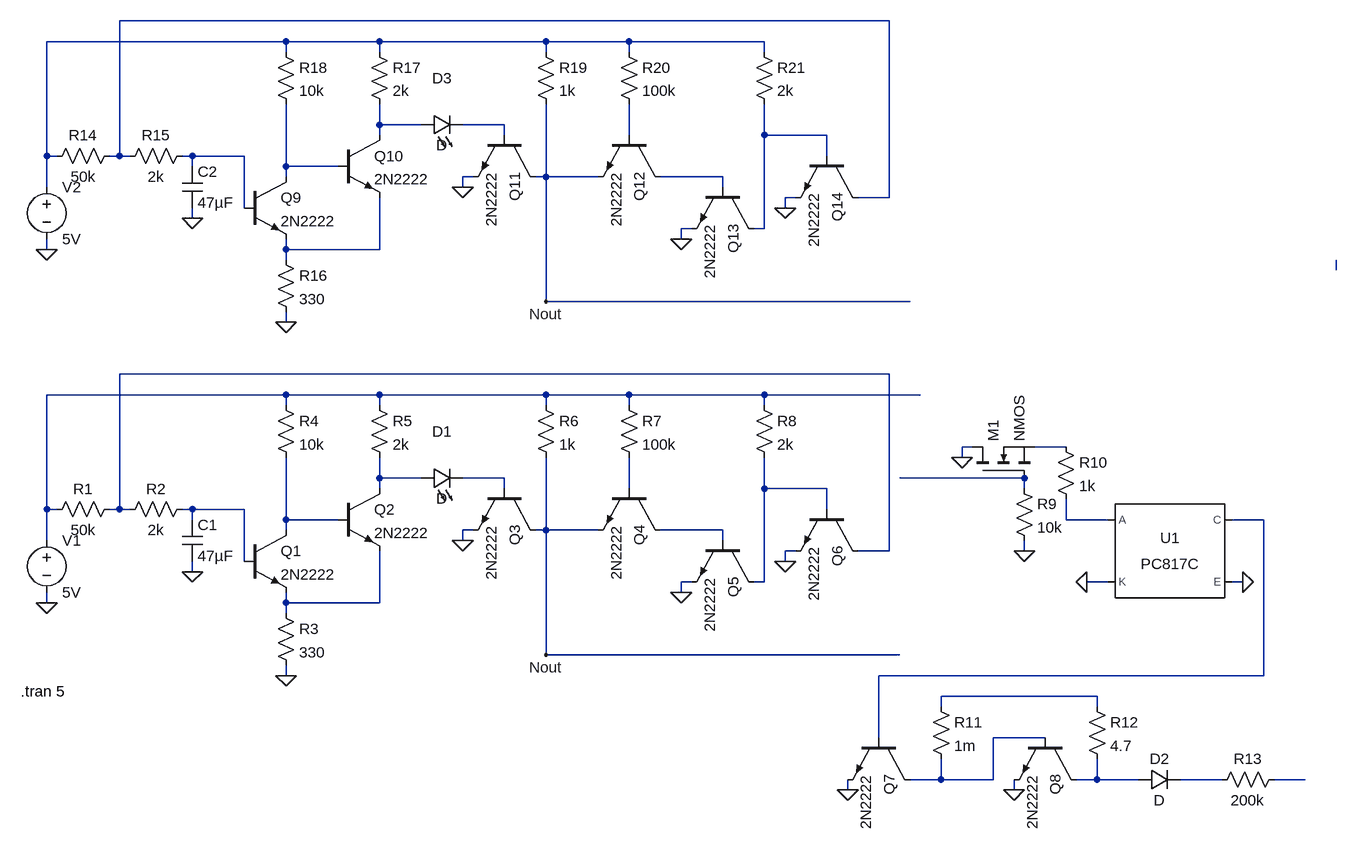
[diagram p0: schematic NeuronSynapseVersion1.asc]
NeuronSynapseVersion1.asc, the LTspice schematic file:
Version 4.1
SHEET 1 2296 680
WIRE 1440 -672 256 -672
WIRE 512 -640 144 -640
WIRE 656 -640 512 -640
WIRE 912 -640 656 -640
WIRE 1040 -640 912 -640
WIRE 1248 -640 1040 -640
WIRE 512 -624 512 -640
WIRE 656 -624 656 -640
WIRE 912 -624 912 -640
WIRE 1040 -624 1040 -640
WIRE 1248 -624 1248 -640
WIRE 656 -512 656 -544
WIRE 720 -512 656 -512
WIRE 848 -512 784 -512
WIRE 656 -496 656 -512
WIRE 848 -496 848 -512
WIRE 1040 -496 1040 -544
WIRE 1248 -496 1248 -544
WIRE 1344 -496 1248 -496
WIRE 144 -464 144 -640
WIRE 160 -464 144 -464
WIRE 256 -464 256 -672
WIRE 256 -464 240 -464
WIRE 272 -464 256 -464
WIRE 368 -464 352 -464
WIRE 448 -464 368 -464
WIRE 1344 -464 1344 -496
WIRE 368 -448 368 -464
WIRE 512 -448 512 -544
WIRE 592 -448 512 -448
WIRE 512 -432 512 -448
WIRE 800 -432 784 -432
WIRE 912 -432 912 -544
WIRE 912 -432 896 -432
WIRE 992 -432 912 -432
WIRE 1184 -432 1088 -432
WIRE 144 -416 144 -464
WIRE 784 -416 784 -432
WIRE 1184 -416 1184 -432
WIRE 1296 -400 1280 -400
WIRE 1440 -400 1440 -672
WIRE 1440 -400 1392 -400
WIRE 448 -384 448 -464
WIRE 1280 -384 1280 -400
WIRE 368 -368 368 -384
WIRE 1136 -352 1120 -352
WIRE 1248 -352 1248 -496
WIRE 1248 -352 1232 -352
WIRE 1120 -336 1120 -352
WIRE 144 -320 144 -336
WIRE 512 -320 512 -336
WIRE 656 -320 656 -400
WIRE 656 -320 512 -320
WIRE 512 -304 512 -320
WIRE 2128 -288 2128 -304
WIRE 912 -240 912 -432
WIRE 1472 -240 912 -240
WIRE 512 -208 512 -224
WIRE 1440 -128 256 -128
WIRE 512 -96 144 -96
WIRE 656 -96 512 -96
WIRE 912 -96 656 -96
WIRE 1040 -96 912 -96
WIRE 1248 -96 1040 -96
WIRE 1488 -96 1248 -96
WIRE 512 -80 512 -96
WIRE 656 -80 656 -96
WIRE 912 -80 912 -96
WIRE 1040 -80 1040 -96
WIRE 1248 -80 1248 -96
WIRE 1568 -16 1552 -16
WIRE 1712 -16 1664 -16
WIRE 1552 0 1552 -16
WIRE 656 32 656 0
WIRE 720 32 656 32
WIRE 848 32 784 32
WIRE 1648 32 1456 32
WIRE 656 48 656 32
WIRE 848 48 848 32
WIRE 1040 48 1040 0
WIRE 1248 48 1248 0
WIRE 1344 48 1248 48
WIRE 1648 48 1648 32
WIRE 144 80 144 -96
WIRE 160 80 144 80
WIRE 256 80 256 -128
WIRE 256 80 240 80
WIRE 272 80 256 80
WIRE 368 80 352 80
WIRE 448 80 368 80
WIRE 1344 80 1344 48
WIRE 368 96 368 80
WIRE 512 96 512 0
WIRE 592 96 512 96
WIRE 1712 96 1712 64
WIRE 1776 96 1712 96
WIRE 2016 96 1968 96
WIRE 512 112 512 96
WIRE 800 112 784 112
WIRE 912 112 912 0
WIRE 912 112 896 112
WIRE 992 112 912 112
WIRE 1184 112 1088 112
WIRE 144 128 144 80
WIRE 784 128 784 112
WIRE 1184 128 1184 112
WIRE 1296 144 1280 144
WIRE 1440 144 1440 -128
WIRE 1440 144 1392 144
WIRE 1648 144 1648 128
WIRE 448 160 448 80
WIRE 1280 160 1280 144
WIRE 368 176 368 160
WIRE 1136 192 1120 192
WIRE 1248 192 1248 48
WIRE 1248 192 1232 192
WIRE 1776 192 1744 192
WIRE 1984 192 1968 192
WIRE 1120 208 1120 192
WIRE 144 224 144 208
WIRE 512 224 512 208
WIRE 656 224 656 144
WIRE 656 224 512 224
WIRE 512 240 512 224
WIRE 912 304 912 112
WIRE 1456 304 912 304
WIRE 512 336 512 320
WIRE 2016 336 2016 96
WIRE 2016 336 1424 336
WIRE 1760 368 1520 368
WIRE 1520 384 1520 368
WIRE 1760 384 1760 368
WIRE 1424 432 1424 336
WIRE 1680 432 1600 432
WIRE 1520 496 1520 464
WIRE 1520 496 1472 496
WIRE 1600 496 1600 432
WIRE 1600 496 1520 496
WIRE 1760 496 1760 464
WIRE 1760 496 1728 496
WIRE 1824 496 1760 496
WIRE 1952 496 1888 496
WIRE 2080 496 2032 496
WIRE 1376 512 1376 496
WIRE 1632 512 1632 496
FLAG 144 224 0
FLAG 368 176 0
FLAG 512 336 0
FLAG 784 128 0
FLAG 1120 208 0
FLAG 1280 160 0
FLAG 912 304 Nout
FLAG 1552 0 0
FLAG 1648 144 0
FLAG 1376 512 0
FLAG 1632 512 0
FLAG 1744 192 0
FLAG 1984 192 0
FLAG 144 -320 0
FLAG 368 -368 0
FLAG 512 -208 0
FLAG 784 -416 0
FLAG 1120 -336 0
FLAG 1280 -384 0
FLAG 912 -240 Nout
SYMBOL voltage 144 112 R0
WINDOW 123 0 0 Left 0
WINDOW 39 0 0 Left 0
SYMATTR InstName V1
SYMATTR Value 5V
SYMBOL res 256 64 R90
WINDOW 0 0 56 VBottom 2
WINDOW 3 32 56 VTop 2
SYMATTR InstName R1
SYMATTR Value 50k
SYMBOL res 368 64 R90
WINDOW 0 0 56 VBottom 2
WINDOW 3 32 56 VTop 2
SYMATTR InstName R2
SYMATTR Value 2k
SYMBOL cap 352 96 R0
SYMATTR InstName C1
SYMATTR Value 47µF
SYMBOL npn 448 112 R0
SYMATTR InstName Q1
SYMATTR Value 2N2222
SYMBOL res 496 224 R0
SYMATTR InstName R3
SYMATTR Value 330
SYMBOL npn 592 48 R0
SYMATTR InstName Q2
SYMATTR Value 2N2222
SYMBOL res 640 -96 R0
SYMATTR InstName R5
SYMATTR Value 2k
SYMBOL res 496 -96 R0
SYMATTR InstName R4
SYMATTR Value 10k
SYMBOL LED 720 48 R270
WINDOW 0 72 32 VTop 2
WINDOW 3 0 32 VBottom 2
SYMATTR InstName D1
SYMBOL npn 896 48 R90
SYMATTR InstName Q3
SYMATTR Value 2N2222
SYMBOL res 896 -96 R0
SYMATTR InstName R6
SYMATTR Value 1k
SYMBOL npn 1088 48 R90
SYMATTR InstName Q4
SYMATTR Value 2N2222
SYMBOL res 1024 -96 R0
SYMATTR InstName R7
SYMATTR Value 100k
SYMBOL npn 1232 128 R90
SYMATTR InstName Q5
SYMATTR Value 2N2222
SYMBOL res 1232 -96 R0
SYMATTR InstName R8
SYMATTR Value 2k
SYMBOL npn 1392 80 R90
SYMATTR InstName Q6
SYMATTR Value 2N2222
SYMBOL nmos 1568 32 R270
SYMATTR InstName M1
SYMBOL res 1696 -32 R0
SYMATTR InstName R10
SYMATTR Value 1k
SYMBOL res 1632 32 R0
SYMATTR InstName R9
SYMATTR Value 10k
SYMBOL res 1504 368 R0
SYMATTR InstName R11
SYMATTR Value 1m
SYMBOL npn 1472 432 R90
SYMATTR InstName Q7
SYMATTR Value 2N2222
SYMBOL npn 1728 432 R90
SYMATTR InstName Q8
SYMATTR Value 2N2222
SYMBOL res 1744 368 R0
SYMATTR InstName R12
SYMATTR Value 4.7
SYMBOL diode 1824 512 R270
WINDOW 0 32 32 VTop 2
WINDOW 3 0 32 VBottom 2
SYMATTR InstName D2
SYMBOL res 2048 480 R90
WINDOW 0 0 56 VBottom 2
WINDOW 3 32 56 VTop 2
SYMATTR InstName R13
SYMATTR Value 200k
SYMBOL Optos\\PC817C 1872 144 R0
SYMATTR InstName U1
SYMBOL voltage 144 -432 R0
WINDOW 123 0 0 Left 0
WINDOW 39 0 0 Left 0
SYMATTR InstName V2
SYMATTR Value 5V
SYMBOL res 256 -480 R90
WINDOW 0 0 56 VBottom 2
WINDOW 3 32 56 VTop 2
SYMATTR InstName R14
SYMATTR Value 50k
SYMBOL res 368 -480 R90
WINDOW 0 0 56 VBottom 2
WINDOW 3 32 56 VTop 2
SYMATTR InstName R15
SYMATTR Value 2k
SYMBOL cap 352 -448 R0
SYMATTR InstName C2
SYMATTR Value 47µF
SYMBOL npn 448 -432 R0
SYMATTR InstName Q9
SYMATTR Value 2N2222
SYMBOL res 496 -320 R0
SYMATTR InstName R16
SYMATTR Value 330
SYMBOL npn 592 -496 R0
SYMATTR InstName Q10
SYMATTR Value 2N2222
SYMBOL res 640 -640 R0
SYMATTR InstName R17
SYMATTR Value 2k
SYMBOL res 496 -640 R0
SYMATTR InstName R18
SYMATTR Value 10k
SYMBOL LED 720 -496 R270
WINDOW 0 72 32 VTop 2
WINDOW 3 0 32 VBottom 2
SYMATTR InstName D3
SYMBOL npn 896 -496 R90
SYMATTR InstName Q11
SYMATTR Value 2N2222
SYMBOL res 896 -640 R0
SYMATTR InstName R19
SYMATTR Value 1k
SYMBOL npn 1088 -496 R90
SYMATTR InstName Q12
SYMATTR Value 2N2222
SYMBOL res 1024 -640 R0
SYMATTR InstName R20
SYMATTR Value 100k
SYMBOL npn 1232 -416 R90
SYMATTR InstName Q13
SYMATTR Value 2N2222
SYMBOL res 1232 -640 R0
SYMATTR InstName R21
SYMATTR Value 2k
SYMBOL npn 1392 -464 R90
SYMATTR InstName Q14
SYMATTR Value 2N2222
TEXT 104 360 Left 2 !.tran 5

The netlist it stands for:
* NeuronSynapseVersion1.asc
V1 N013 0 5V
R1 N012 N013 50k
R2 N020 N012 2k
C1 N020 0 47µF
Q1 N021 N020 N025 0 2N2222
R3 N025 0 330
Q2 N015 N021 N025 0 2N2222
R5 N013 N015 2k
R4 N013 N021 10k
D1 N015 N016 D
Q3 Nout N016 0 0 2N2222
R6 N013 Nout 1k
Q4 N024 N018 Nout 0 2N2222
R7 N013 N018 100k
Q5 N019 N024 0 0 2N2222
R8 N013 N019 2k
Q6 N012 N019 0 0 2N2222
M1 0 N017 N014 N014 NMOS
R10 N014 N022 1k
R9 N017 0 10k
R11 N026 N027 1m
Q7 N027 N023 0 0 2N2222
Q8 N028 N027 0 0 2N2222
R12 N026 N028 4.7
D2 N028 N029 D
R13 N030 N029 200k
X§U1 N022 0 N023 0 PC817 Igain=2.3m  ; PC817C, pins A K C E
V2 N002 0 5V
R14 N001 N002 50k
R15 N007 N001 2k
C2 N007 0 47µF
Q9 N008 N007 N010 0 2N2222
R16 N010 0 330
Q10 N003 N008 N010 0 2N2222
R17 N002 N003 2k
R18 N002 N008 10k
D3 N003 N004 D
Q11 Nout N004 0 0 2N2222
R19 N002 Nout 1k
Q12 N009 N005 Nout 0 2N2222
R20 N002 N005 100k
Q13 N006 N009 0 0 2N2222
R21 N002 N006 2k
Q14 N001 N006 0 0 2N2222
.model D D
.lib standard.dio
.model NPN NPN
.model PNP PNP
.lib standard.bjt
.model NMOS NMOS
.model PMOS PMOS
.lib standard.mos
.tran 5
.lib PC817.sub
.backanno
.end